# Altium project Diplomski.PrjPcb
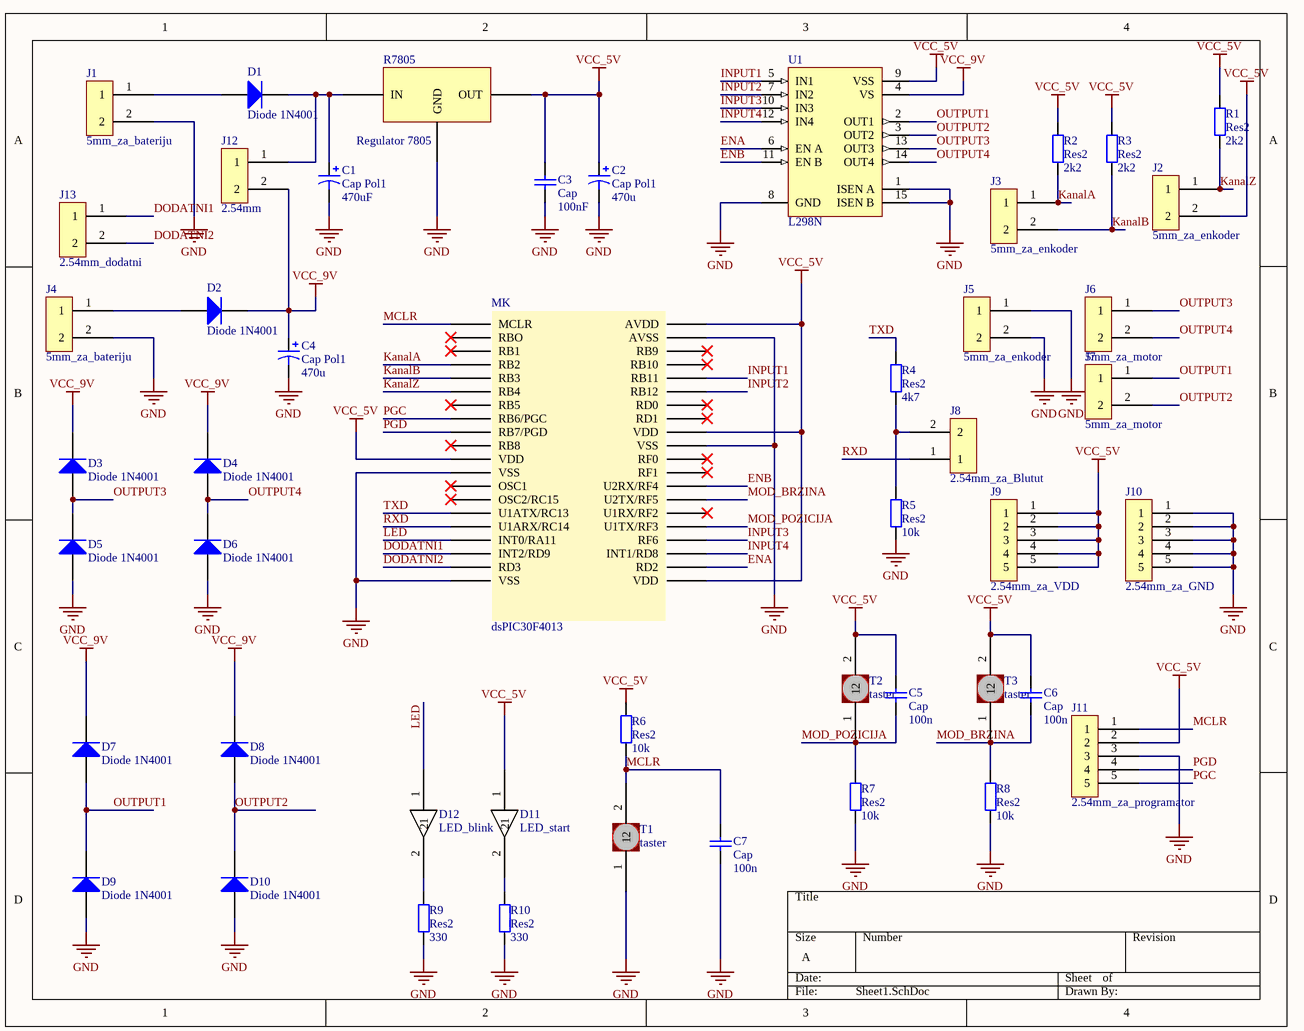
[diagram p0: Sheet1.SchDoc]
1 sheet, 48 parts. Net scope: global (net labels, ports and power ports of the same name join across sheets).
Board file: PCB1.PcbDoc

## Sheet Sheet1.SchDoc
size A

### Parts
C1  Cap Pol1  value 470uF  [RB7.6-15]
C2  Cap Pol1  value 470u  [RB7.6-15]
C3  Cap  value 100nF  [RAD-0.3]
C4  Cap Pol1  value 470u  [RB7.6-15]
C5  Cap  value 100n  [RAD-0.3]
C6  Cap  value 100n  [RAD-0.3]
C7  Cap  value 100n  [RAD-0.3]
D1  Diode 1N4001  [DO-41]
D2  Diode 1N4001  [DO-41]
D3  Diode 1N4001  [DO-41]
D4  Diode 1N4001  [DO-41]
D5  Diode 1N4001  [DO-41]
D6  Diode 1N4001  [DO-41]
D7  Diode 1N4001  [DO-41]
D8  Diode 1N4001  [DO-41]
D9  Diode 1N4001  [DO-41]
D10  Diode 1N4001  [DO-41]
D11  LED_start  [PCBComponent_1]
D12  LED_blink  [PCBComponent_1]
J1  5mm_za_bateriju  [PCBComponent_1]
J2  5mm_za_enkoder  [PCBComponent_1]
J3  5mm_za_enkoder  [PCBComponent_1]
J4  5mm_za_bateriju  [PCBComponent_1]
J5  5mm_za_enkoder  [PCBComponent_1]
J6  5mm_za_motor  [PCBComponent_1]
J7  5mm_za_motor  [PCBComponent_1]
J8  2.54mm_za_Blutut  [PCBComponent_1]
J9  2.54mm_za_VDD  [PCBComponent_1]
J10  2.54mm_za_GND  [PCBComponent_1]
J11  2.54mm_za_programator  [PCBComponent_1]
J12  2.54mm  [PCBComponent_1]
J13  2.54mm_dodatni  [PCBComponent_1]
MK  dsPIC30F4013  [PCBComponent_1]
R1  Res2  value 2k2  [AXIAL-0.4]
R2  Res2  value 2k2  [AXIAL-0.4]
R3  Res2  value 2k2  [AXIAL-0.4]
R4  Res2  value 4k7  [AXIAL-0.4]
R5  Res2  value 10k  [AXIAL-0.4]
R6  Res2  value 10k  [AXIAL-0.4]
R7  Res2  value 10k  [AXIAL-0.4]
R8  Res2  value 10k  [AXIAL-0.4]
R9  Res2  value 330  [AXIAL-0.4]
R10  Res2  value 330  [AXIAL-0.4]
R7805  Regulator 7805  [PCBComponent_1]
T1  taster  [PCBComponent_1]
T2  taster  [PCBComponent_1]
T3  taster  [PCBComponent_1]
U1  L298N  [Multiwatt15V]

### Nets
GND: C1.2 C2.2 C3.1 C4.2 C7.1 D5.1(A) D6.1(A) D9.1(A) D10.1(A) J1.2 J4.2 J5.1 J5.2 J10.1 J10.2 J10.3 J10.4 J10.5 J11.3 MK.12(VSS) MK.20(VSS) MK.31(VSS) MK.39(AVSS) R5.1 R7.1 R8.1 R9.1 R10.1 R7805.2(GND) T1.1 U1.1(ISEN_A) U1.8(GND) U1.15(ISEN_B)
VCC_5V: C2.1 C3.2 C5.2 C6.2 D11.1 J2.2 J9.1 J9.2 J9.3 J9.4 J9.5 J11.2 MK.11(VDD) MK.21(VDD) MK.32(VDD) MK.40(AVDD) R1.2 R2.2 R3.2 R6.2 R7805.3(OUT) T2.2 T3.2 U1.9(VSS)
VCC_9V: C4.1 D2.2(K) D3.2(K) D4.2(K) D7.2(K) D8.2(K) J12.2 U1.4(VS)
DODATNI1: J13.1 MK.18(INT2/RD9)
DODATNI2: J13.2 MK.19(RD3)
ENA: MK.22(RD2) U1.6(EN_A)
ENB: MK.28(U2RX/RF4) U1.11(EN_B)
INPUT1: MK.36(RB11) U1.5(IN1)
INPUT2: MK.35(RB12) U1.7(IN2)
INPUT3: MK.24(RF6) U1.10(IN3)
INPUT4: MK.23(INT1/RD8) U1.12(IN4)
KanalA: J3.1 MK.4(RB2) R2.1
KanalB: J3.2 MK.5(RB3) R3.1
KanalZ: J2.1 MK.6(RB4) R1.1
LED: D12.1 MK.17(INT0/RA11)
MCLR: C7.2 J11.1 MK.1(MCLR) R6.1 T1.2
MOD_BRZINA: C6.1 MK.27(U2TX/RF5) R8.2 T3.1
MOD_POZICIJA: C5.1 MK.25(U1TX/RF3) R7.2 T2.1
OUTPUT1: D7.1(A) D9.2(K) J7.1 U1.2(OUT1)
OUTPUT2: D8.1(A) D10.2(K) J7.2 U1.3(OUT2)
OUTPUT3: D3.1(A) D5.2(K) J6.1 U1.13(OUT3)
OUTPUT4: D4.1(A) D6.2(K) J6.2 U1.14(OUT4)
PGC: J11.5 MK.8(RB6/PGC)
PGD: J11.4 MK.9(RB7/PGD)
RXD: J8.1 MK.16(U1ARX/RC14)
TXD: MK.15(U1ATX/RC13) R4.2
NetC1_1: C1.1 D1.2(K) J12.1 R7805.1(IN)
NetD1_1: D1.1(A) J1.1
NetD2_1: D2.1(A) J4.1
NetD11_2: D11.2 R10.2
NetD12_2: D12.2 R9.2
NetJ8_2: J8.2 R4.1 R5.2

Not connected (* = marked no-connect by the designer): MK 2(RBO)* 3(RB1)* 7(RB5)* 10(RB8)* 13(OSC1)* 14(OSC2/RC15)* 26(U1RX/RF2)* 29(RF1)* 30(RF0)* 33(RD1)* 34(RD0)* 37(RB10)* 38(RB9)*

### Library data of the parts
C1 C2 C4 = Cap Pol1: Polarized Capacitor (Radial); Published: 8-Jun-2000; LatestRevisionDate: 17-Jul-2002; LatestRevisionNote: Re-released for DXP Platform.; PackageReference: RB7.6-15; Publisher: Altium Limited; PackageDescription: Polarized Capacitor (Radial); 2 Leads
C3 C5-C7 = Cap: Capacitor; Published: 8-Jun-2000; LatestRevisionDate: 17-Jul-2002; LatestRevisionNote: Re-released for DXP Platform.; PackageReference: RAD-0.3; Publisher: Altium Limited; PackageDescription: Radial Cap, Thru-Hole; 2 Leads; 0.3 in Pin Spacing
D1-D10 = Diode 1N4001: 1 Amp General Purpose Rectifier; Published: 8-Jun-2000; LatestRevisionDate: 17-Jul-2002; LatestRevisionNote: Re-released for DXP Platform.; DatasheetVersion: 1998; PackageVersion: Aug-1999; PackageReference: DO-41; Publisher: Altium Limited; PackageDescription: Diode, Axial; Body 5.2 x 2.7 mm (LxDia. max), Lead Dia. 0.86 mm (max); Code_JEDEC: DO-204-AL; ComponentLink1Description: Manufacturer Link; ComponentLink1URL: http://www.fairchildsemi.com/; ComponentLink2Description: Datasheet; ComponentLink2URL: http://www.fairchildsemi.com/ds/1N%2F1N4001.pdf
D11 D12 J1-J13 MK R7805 T1-T3 = Component_1
R1-R10 = Res2: Resistor; Published: 8-Jun-2000; LatestRevisionDate: 17-Jul-2002; LatestRevisionNote: Re-released for DXP Platform.; PackageReference: AXIAL-0.4; Publisher: Altium Limited; PackageDescription: Axial Device, Thru-Hole; 2 Leads; 0.4 in Pin Spacing
U1 = L298N: Dual Full Bridge Driver; Published: 8-Jun-2000; LatestRevisionDate: 14-May-2007; LatestRevisionNote: Mapped to vertical PCB.; DatasheetVersion: Jul-1999; PackageReference: Multiwatt15V; Publisher: Altium Limited; PackageDescription: TO, Thru-Hole, Vertical, Heatsink Mounted; 15 Bent Staggered Leads; Pitch 1.27 mm; ComponentLink1Description: Manufacturer Link; ComponentLink1URL: http://www.st.com/; ComponentLink2Description: Datasheet; ComponentLink2URL: http://www.st.com/stonline/products/literature/ds/1773/l298.pdf